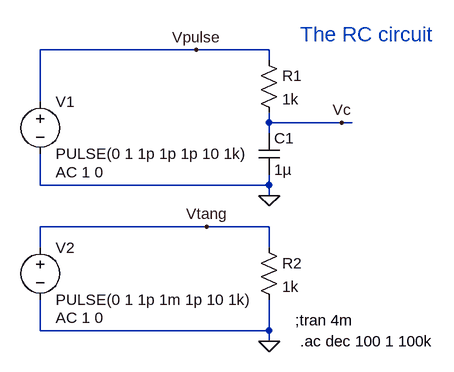
[diagram p0: schematic RC.asc]
RC.asc, the LTspice schematic file:
Version 4
SHEET 1 880 680
WIRE 144 -32 -96 -32
WIRE 256 -32 144 -32
WIRE 256 -16 256 -32
WIRE -96 48 -96 -32
WIRE 256 80 256 64
WIRE 368 80 256 80
WIRE 384 80 368 80
WIRE 256 96 256 80
WIRE -96 176 -96 128
WIRE 256 176 256 160
WIRE 256 176 -96 176
WIRE 256 192 256 176
WIRE 160 240 -96 240
WIRE 256 240 160 240
WIRE -96 272 -96 240
WIRE 256 272 256 240
WIRE -96 400 -96 352
WIRE 256 400 256 352
WIRE 256 400 -96 400
WIRE 256 416 256 400
FLAG 368 80 Vc
FLAG 144 -32 Vpulse
FLAG 256 192 0
FLAG 160 240 Vtang
FLAG 256 416 0
SYMBOL cap 240 96 R0
SYMATTR InstName C1
SYMATTR Value 1µ
SYMBOL res 240 -32 R0
SYMATTR InstName R1
SYMATTR Value 1k
SYMBOL voltage -96 32 R0
WINDOW 123 24 124 Left 2
WINDOW 39 0 0 Left 2
SYMATTR InstName V1
SYMATTR Value PULSE(0 1 1p 1p 1p 10 1k)
SYMATTR Value2 AC 1 0
SYMBOL voltage -96 256 R0
WINDOW 123 24 124 Left 2
WINDOW 39 0 0 Left 2
SYMATTR InstName V2
SYMATTR Value PULSE(0 1 1p 1m 1p 10 1k)
SYMATTR Value2 AC 1 0
SYMBOL res 240 256 R0
SYMATTR InstName R2
SYMATTR Value 1k
TEXT 296 384 Left 2 !;tran 4m
TEXT 304 416 Left 2 !.ac dec 100 1 100k
TEXT 304 -56 Left 3 ;The RC circuit

The netlist it stands for:
* RC.asc
C1 Vc 0 1µ
R1 Vpulse Vc 1k
V1 Vpulse 0 PULSE(0 1 1p 1p 1p 10 1k) AC 1 0
V2 Vtang 0 PULSE(0 1 1p 1m 1p 10 1k) AC 1 0
R2 Vtang 0 1k
;tran 4m
.ac dec 100 1 100k
* The RC circuit
.backanno
.end